# Altium schematic sheet Regelaar.SchDoc
size A4; SheetNumber: 4; SheetTotal: 5
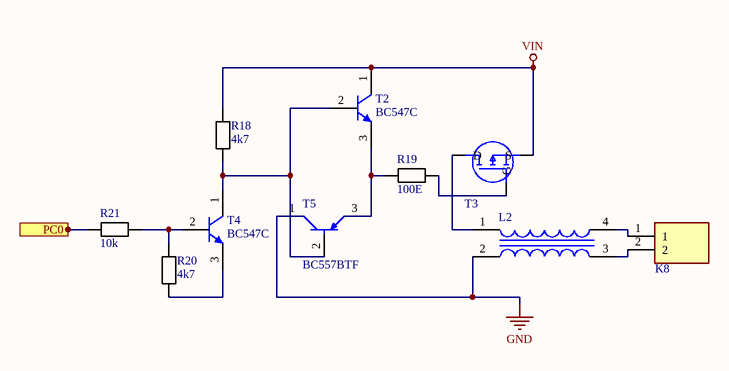
[diagram p0: Regelaar.SchDoc]

## Parts
K8  282836-2  [Schroefconnector 2 Pin - duplicate]  (value not drawn)
L2  Smoorspoel commom mode  [Common mode smoorspoel]  (value not drawn)
R18  4k7  [weerstand]
R19  100E  [weerstand]
R20  4k7  [weerstand]
R21  10k  [weerstand]
T2  BC547C  [BC547C (transistor)]
T3  IRF9Z34NPBF  [MOSFET]  (value not drawn)
T4  BC547C  [BC547C (transistor)]
T5  BC557BTF  [transistor BC557]

## Ports
PC0 (see CPU[2B])

## Nets
GND: L2.2(SEC+) T5.1(C)
VIN: R18.2 T2.1(C) T3.2(S)
PC0: R21.1 ; port PC0
NetK8_1: K8.1 L2.4(PRI-)
NetK8_2: K8.2 L2.3(SEC-)
NetL2_1: L2.1(PRI+) T3.3(D)
NetR18_1: R18.1 T2.2(B) T4.1(C) T5.2(B)
NetR19_1: R19.1 T2.3(E) T5.3
NetR19_2: R19.2 T3.1(G)
NetR20_1: R20.1 T4.3(E)
NetR20_2: R20.2 R21.2 T4.2(B)

## Library data of the parts
K8 = Schroefconnector 2 Pin R: Connector; Manufacturer_Name: TE Connectivity; Datasheet Link: https://www.te.com/commerce/DocumentDelivery/DDEController?Action=showdoc&DocId=Customer+Drawing%7F282836%7FJ%7Fpdf%7FEnglish%7FENG_CD_282836_J.pdf%7F282836-2; Height: 10mm; Manufacturer_Part_Number: 282836-2
L2 = Smoorspoel commom mode: Transformer CM2545X171B-10; Manufacturer_Name: Laird Technologies; Datasheet Link: https://datasheet.datasheetarchive.com/originals/dk/DKDS-7/122753.pdf; Height: 9.5mm; Manufacturer_Part_Number: CM2545X171B-10
R18-R21 = weerstand: Manufacturer: Vishay Dale; Part Number: CRCW08050000Z0EA
T2 T4 = BC547C: Amplifier Transistor, NPN Silicon, 3-Pin, 0,1A TO-92, Bulk Box; Manufacturer: On Semiconductor; IC Continuous (A): 0.1; fT Min (MHz): 150; Mounting Technology: Through Hole; ComponentLink1URL: http://www.onsemi.com/; ComponentLink1Description: Manufacturer URL; ComponentLink3URL: http://www.onsemi.cn/pub_link/Collateral/2N6426-D.PDF; DatasheetVersion: Rev. 7; PackageVersion: Rev. AM; Packing: Bulk Box; RoHS: FALSE; Polarity: NPN; PartNumber: BC547C; ComponentLink2URL: http://www.onsemi.com/pub_link/Collateral/BC546-D.PDF; ComponentLink3Description: Package Specification; PackageDescription: 3-Pin Transistor Outline, Body 4.825 x 3.685 mm, Pitch 1.27 mm; PackageReference: TO-92-3-29-11_AM_SL; ComponentLink2Description: Datasheet
T3 = MOSFET: MOSFET (P-Channel); Manufacturer_Name: Infineon; Datasheet Link: https://componentsearchengine.com//IRF9Z34NPBF.pdf; Height: 4.69mm; Mouser2 Part Number: 942-IRF9Z34NPBF; Mouser2 Price/Stock: https://www.mouser.com/Search/Refine.aspx?Keyword=942-IRF9Z34NPBF; Manufacturer_Part_Number: IRF9Z34NPBF
T5 = BC557: BC557BTF Small Signal Bipolar Transistor, 0.1A I(C), 45V V(BR)CEO, 1-Element, PNP, Silicon, TO-92; Manufacturer Lifecycle Status: ACTIVE; NexarPartId: 84408945; Max Power Dissipation: 500mW; Frequency: 150MHz; hFE Min: 110; Number of Elements: 1; Current Rating: -100mA; Collector Emitter Saturation Voltage: -250mV; Max Collector Current: 100mA; Emitter Base Voltage (VEBO): -5V; Voltage Rating (DC): -45V; Element Configuration: Single; Max Frequency: 10MHz; Collector Base Voltage (VCBO): -50V; Collector Emitter Voltage (VCEO): 45V; Contact Plating: Tin; Min Operating Temperature: -65°C; RoHS: Compliant; Max Operating Temperature: 150°C; Weight: 240mg; Power Dissipation: 500mW; Lifecycle Status: Production; Case/Package: TO-92; Collector Emitter Breakdown Voltage: 45V; Length: 5.2mm; Schedule B: 8541210080, 8541210080|8541210080|8541210080|8541210080|8541210080; Lead Free: Lead Free; Polarity: PNP; REACH SVHC: No SVHC; Mount: Through Hole; Max Breakdown Voltage: 45V; Transition Frequency: 150MHz; Height: 5.33mm; Number of Pins: 3; Gain Bandwidth Product: 150MHz; Width: 4.19mm